# Altium schematic sheet Sheet1.SchDoc
size A; SheetNumber: 1; SheetTotal: 2
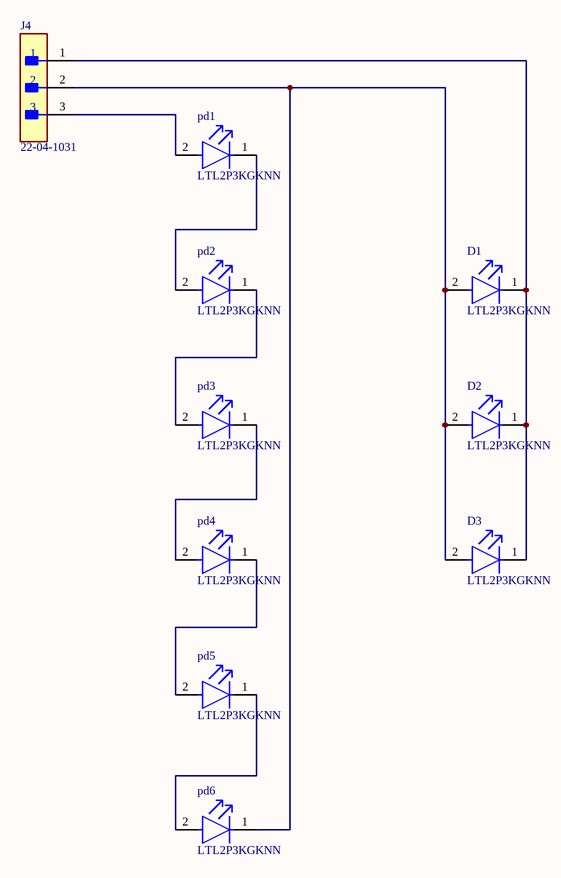
[diagram p0: Sheet1.SchDoc]

## Parts
D1  LTL2P3KGKNN  [FP-LTL2P3KGKNN-MFG]
D2  LTL2P3KGKNN  [FP-LTL2P3KGKNN-MFG]
D3  LTL2P3KGKNN  [FP-LTL2P3KGKNN-MFG]
J4  22-04-1031  [FP-22-04-1031-MFG]
pd1  LTL2P3KGKNN  [FP-LTL2P3KGKNN-MFG]
pd2  LTL2P3KGKNN  [FP-LTL2P3KGKNN-MFG]
pd3  LTL2P3KGKNN  [FP-LTL2P3KGKNN-MFG]
pd4  LTL2P3KGKNN  [FP-LTL2P3KGKNN-MFG]
pd5  LTL2P3KGKNN  [FP-LTL2P3KGKNN-MFG]
pd6  LTL2P3KGKNN  [FP-LTL2P3KGKNN-MFG]

## Nets
NetD1_1: D1.1(C) D2.1(C) D3.1(C) J4.1
NetD1_2: D1.2(A) D2.2(A) D3.2(A) J4.2 pd6.1(C)
NetJ4_3: J4.3 pd1.2(A)
Netpd1_1: pd1.1(C) pd2.2(A)
Netpd2_1: pd2.1(C) pd3.2(A)
Netpd3_1: pd3.1(C) pd4.2(A)
Netpd4_1: pd4.1(C) pd5.2(A)
Netpd5_1: pd5.1(C) pd6.2(A)

## Library data of the parts
D1-D3 pd1-pd6 = CMP-22017-000002-1: LED GREEN CLEAR T-1 3/4 T/H; Manufacturer: Lite-On; Forward Voltage: 2.1V; Led Orientation: Straight; Forward Current: 20mA; Luminous Intensity: 980mcd; Wavelength: 572nm; Power Dissipation: 75mW; Peak Emmision Wavelength: 575nm; Viewing Angle: 22°; Reverse Voltage: 5V; Category: Diode; Temperature Range Low: -40°C; Device Class L1: Optoelectronics; Temperature: -40°C to +100°C; Mouser Description: LED Uni-Color Green 575nm 2-Pin T-1 3/4; Height: 9.95mm; Package: 0; Colour: Green; ComponentLink2Description: Datasheet; Digikey Description: LED GREEN CLEAR T-1 3/4 T/H; Automotive: No; Lead Free: Yes; ComponentLink2URL: https://optoelectronics.liteon.com/upload/download/DS20-2000-193/LTL2P3KGKNN.pdf; Manufacturer Part Number: LTL2P3KGKNN; Temperature Range High: +100°C; RoHS: TRUE; Device Class L2: LEDs; Device Class L3: unset; Octopart: https://octopart.com/ltl2p3kgknn-lite-on-550036
J4 = CMP-04776-000410-1: CONN HEADER VERT 3POS 2.5MM; Voltage Rating (AC): 250V; Number of Contacts: 3; Max Voltage Rating (DC): 250.25kV; Contact Resistance: 20mR; Hole Diameter: 1.19mm; Gender: Male; Connector Type: Male Pin; Insulation Resistance: 1GR; Glow Wire Compliant: Non-compliant; Current Rating: 3A; Contact Material: Brass; Series: KK; Number of Positions: 3; Contact Gender: Male; Mount: Through Hole; Working Voltage: 250V; Number of Poles: 3; Termination: Solder; Radiation Hardening: No; Lead Free: Lead Free; Min Operating Temperature: -40°C; Contact Mating Length: 0.295inch; Packaging: Bulk; Lead Pitch: 2.5mm; Voltage Rating: 250V; Voltage Rating (DC): 250V; Orientation: Straight; Color: Natural; Flammability Rating: UL94 V-0; Housing Material: Nylon; Pitch: 2.5mm; Contact Type: Male Pin; Number of Rows: 1; Housing Color: Natural; Max Operating Temperature: 105°C; Fastening Type: Friction; Halogen Free: Low Halogen; Contact Plating: Tin; Package Quantity: 1; Number of Circuits: 3